# Altium schematic sheet schematic.SchDoc
size A3; SheetNumber: 1; SheetTotal: 1
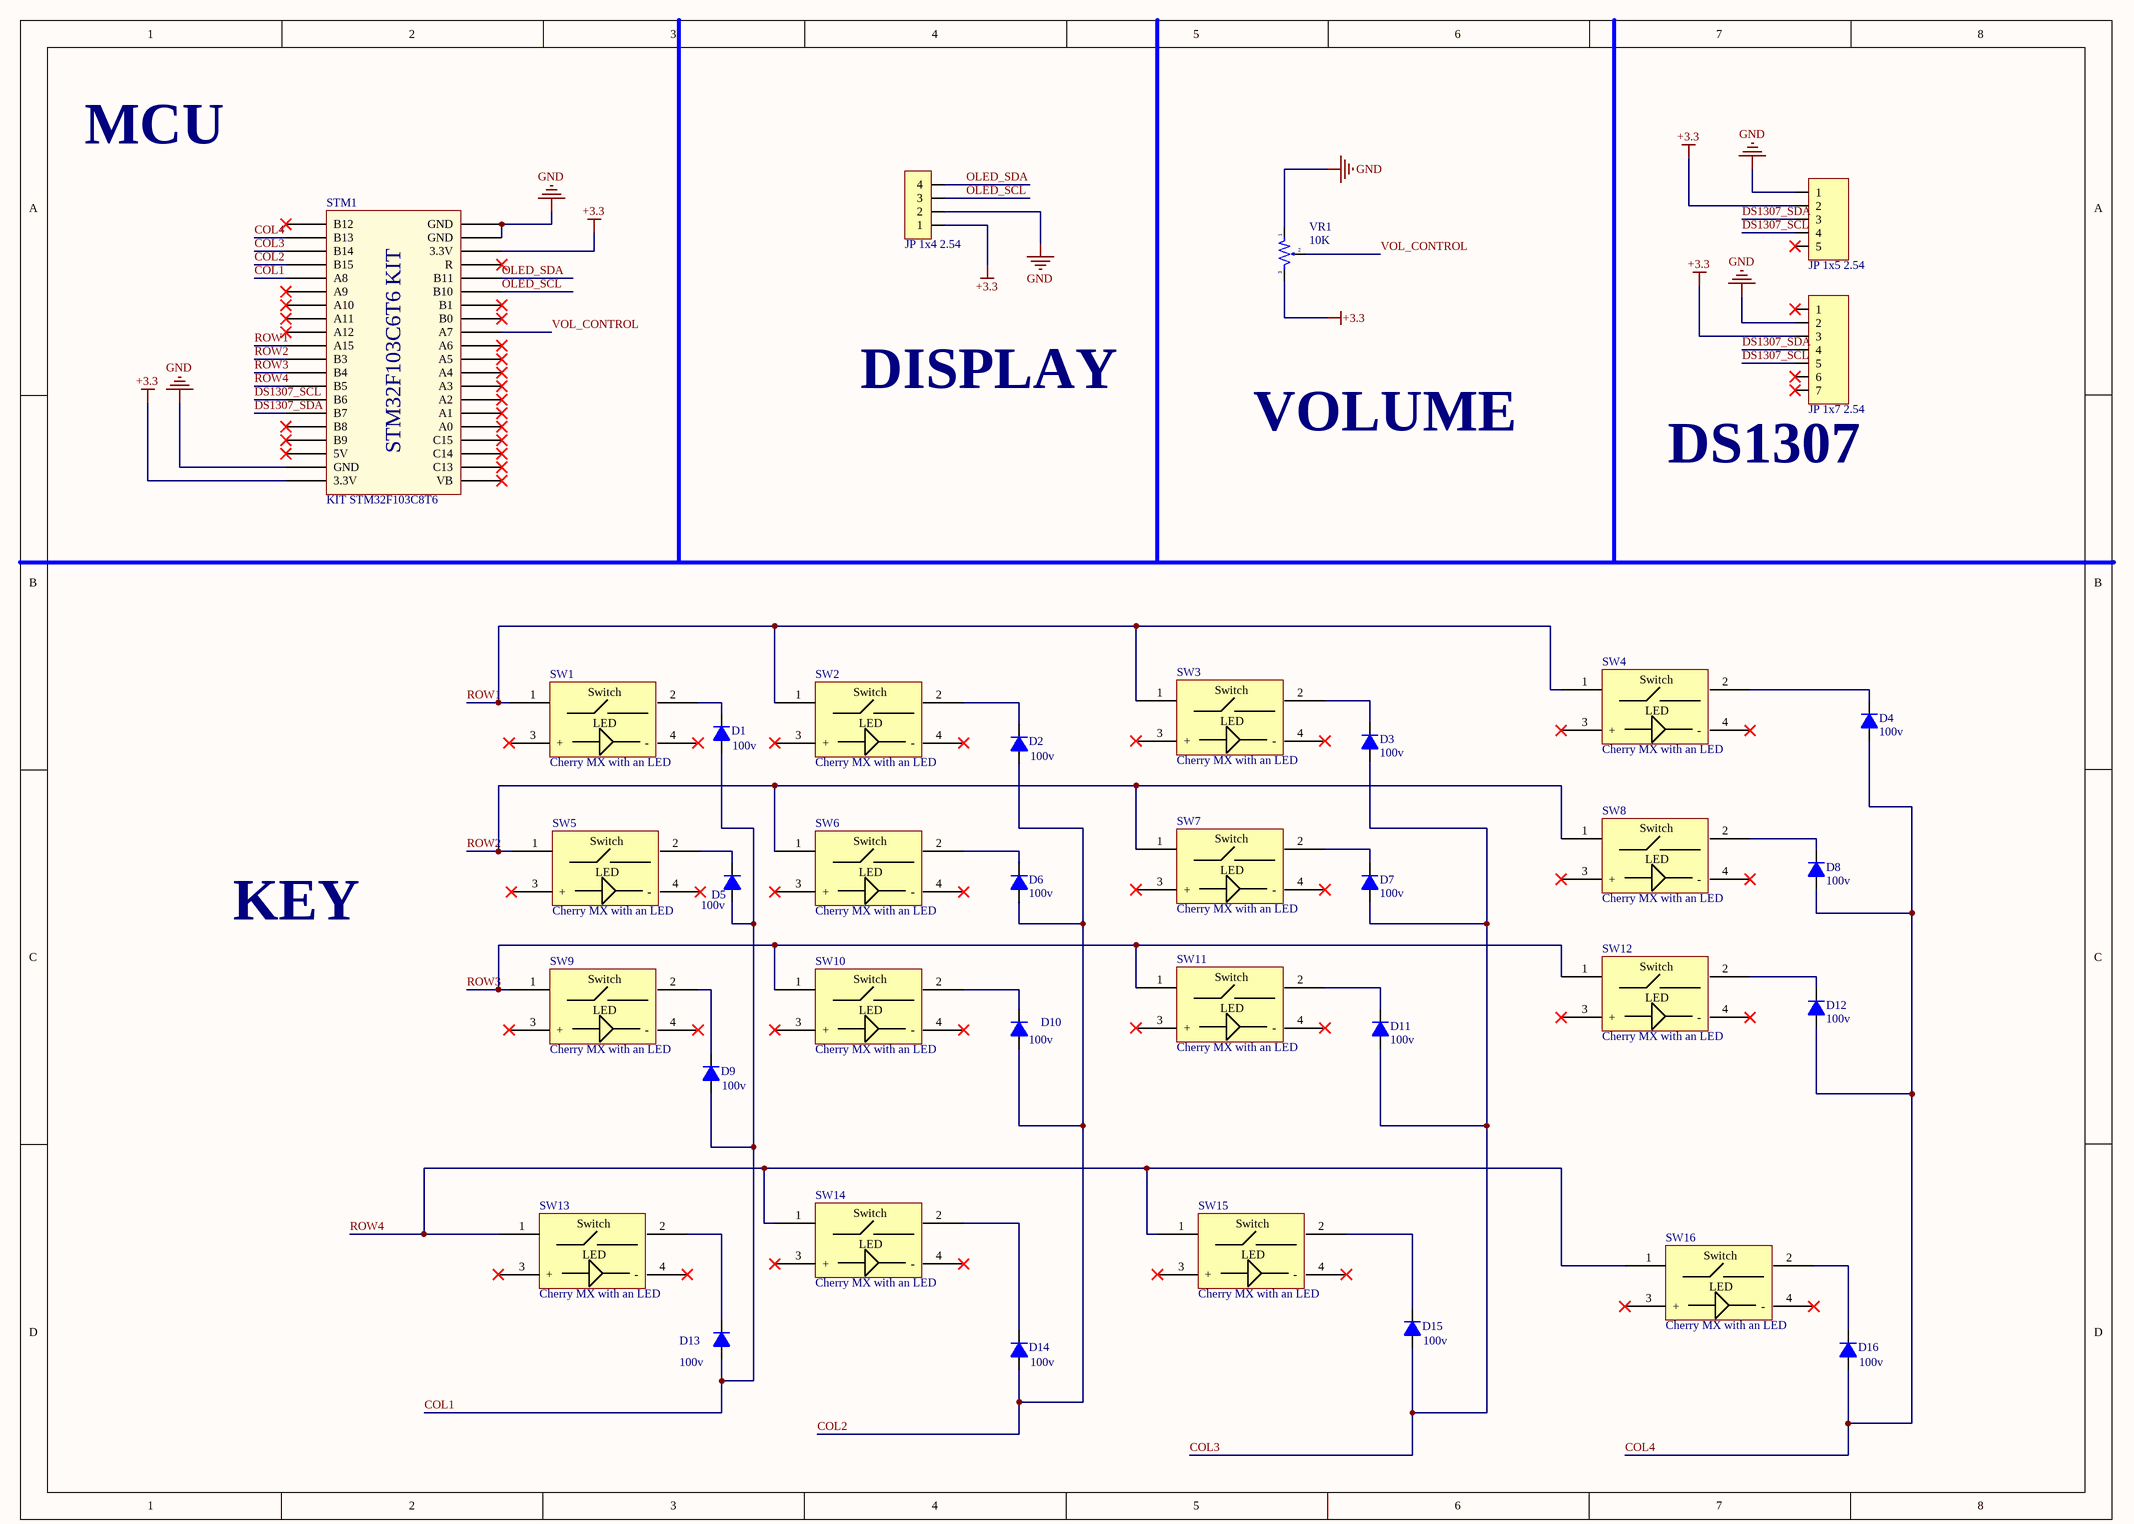
[diagram p0: schematic.SchDoc]

## Parts
D1  100v  [DIODE 0.5A]
D2  100v  [DIODE 0.5A]
D3  100v  [DIODE 0.5A]
D4  100v  [DIODE 0.5A]
D5  100v  [DIODE 0.5A]
D6  100v  [DIODE 0.5A]
D7  100v  [DIODE 0.5A]
D8  100v  [DIODE 0.5A]
D9  100v  [DIODE 0.5A]
D10  100v  [DIODE 0.5A]
D11  100v  [DIODE 0.5A]
D12  100v  [DIODE 0.5A]
D13  100v  [DIODE 0.5A]
D14  100v  [DIODE 0.5A]
D15  100v  [DIODE 0.5A]
D16  100v  [DIODE 0.5A]
JP1  JP 1x4 2.54  [JP 1x4 CT]
JP2  JP 1x5 2.54  [JP 1x5 CT]
JP3  JP 1x7 2.54  [JP 1x7 CT]
STM1  KIT STM32F103C8T6  [STM32F103 KIT]
SW1  Cherry MX with an LED  [MX_Cherry_LED]
SW2  Cherry MX with an LED  [MX_Cherry_LED]
SW3  Cherry MX with an LED  [MX_Cherry_LED]
SW4  Cherry MX with an LED  [MX_Cherry_LED]
SW5  Cherry MX with an LED  [MX_Cherry_LED]
SW6  Cherry MX with an LED  [MX_Cherry_LED]
SW7  Cherry MX with an LED  [MX_Cherry_LED]
SW8  Cherry MX with an LED  [MX_Cherry_LED]
SW9  Cherry MX with an LED  [MX_Cherry_LED]
SW10  Cherry MX with an LED  [MX_Cherry_LED]
SW11  Cherry MX with an LED  [MX_Cherry_LED]
SW12  Cherry MX with an LED  [MX_Cherry_LED]
SW13  Cherry MX with an LED  [MX_Cherry_LED]
SW14  Cherry MX with an LED  [MX_Cherry_LED]
SW15  Cherry MX with an LED  [MX_Cherry_LED]
SW16  Cherry MX with an LED  [MX_Cherry_LED]
VR1  10K  [Bien Tro Volume Don]

## Nets
+3.3: JP1.1 JP2.2 JP3.3 STM1.20(3.3V) STM1.38(3.3V) VR1.3
GND: JP1.2 JP2.1 JP3.2 STM1.19(GND) STM1.39(GND) STM1.40(GND) VR1.1
COL1: D1.1(A) D5.1(A) D9.1(A) D13.1(A) STM1.5(A8)
COL2: D2.1(A) D6.1(A) D10.1(A) D14.1(A) STM1.4(B15)
COL3: D3.1(A) D7.1(A) D11.1(A) D15.1(A) STM1.3(B14)
COL4: D4.1(A) D8.1(A) D12.1(A) D16.1(A) STM1.2(B13)
DS1307_SCL: JP2.4 JP3.5 STM1.14(B6)
DS1307_SDA: JP2.3 JP3.4 STM1.15(B7)
OLED_SCL: JP1.3 STM1.35(B10)
OLED_SDA: JP1.4 STM1.36(B11)
ROW1: STM1.10(A15) SW1.1 SW2.1 SW3.1 SW4.1
ROW2: STM1.11(B3) SW5.1 SW6.1 SW7.1 SW8.1
ROW3: STM1.12(B4) SW9.1 SW10.1 SW11.1 SW12.1
ROW4: STM1.13(B5) SW13.1 SW14.1 SW15.1 SW16.1
VOL_CONTROL: STM1.32(A7) VR1.2
NetD1_2: D1.2(K) SW1.2
NetD2_2: D2.2(K) SW2.2
NetD3_2: D3.2(K) SW3.2
NetD4_2: D4.2(K) SW4.2
NetD5_2: D5.2(K) SW5.2
NetD6_2: D6.2(K) SW6.2
NetD7_2: D7.2(K) SW7.2
NetD8_2: D8.2(K) SW8.2
NetD9_2: D9.2(K) SW9.2
NetD10_2: D10.2(K) SW10.2
NetD11_2: D11.2(K) SW11.2
NetD12_2: D12.2(K) SW12.2
NetD13_2: D13.2(K) SW13.2
NetD14_2: D14.2(K) SW14.2
NetD15_2: D15.2(K) SW15.2
NetD16_2: D16.2(K) SW16.2

Not connected (* = marked no-connect by the designer): JP2 5*; JP3 1* 6* 7*; STM1 1(B12)* 6(A9)* 7(A10)* 8(A11)* 9(A12)* 16(B8)* 17(B9)* 18(5V)* 21(VB)* 22(C13)* 23(C14)* 24(C15)* 25(A0)* 26(A1)* 27(A2)* 28(A3)* 29(A4)* 30(A5)* 31(A6)* 33(B0)* 34(B1)* 37(R)*; SW1 3(+)* 4(-)*; SW2 3(+)* 4(-)*; SW3 3(+)* 4(-)*; SW4 3(+)* 4(-)*; SW5 3(+)* 4(-)*; SW6 3(+)* 4(-)*; SW7 3(+)* 4(-)*; SW8 3(+)* 4(-)*; SW9 3(+)* 4(-)*; SW10 3(+)* 4(-)*; SW11 3(+)* 4(-)*; SW12 3(+)* 4(-)*; SW13 3(+)* 4(-)*; SW14 3(+)* 4(-)*; SW15 3(+)* 4(-)*; SW16 3(+)* 4(-)*

## Notes on the sheet
- MCU
- DISPLAY
- VOLUME
- (near JP3) DS1307
- KEY
- (in symbol MX_Cherry_LED) Switch; LED
- (in symbol STM32f103 Bluepill) STM32F103C6T6 KIT

## Library data of the parts
D1-D16 = Diode 1N4148: Cắm; Ten_Linh_Kien: Diode 1N4148 DO35 450mA 100V ( 1N4148 DIP); Don_Vi: Con; Ma_Hang: MH001065; Ghi Chu: *; Kieu_Chan: *; Chung_Loai: Cắm
JP1 = JP 1x4 2.54 Cai Thang: Cắm; Ten_Linh_Kien: Jump Đơn Cái 2.54MM 1x20P Thẳng; Don_Vi: Con; Ma_Hang: MH004006; Ghi_Chu: *; Kieu_Chan: *; Chung_Loai: Cắm
JP2 = JP 1x5 2.54 Cai Thang: Cắm; Ten_Linh_Kien: Jump Đơn Cái 2.54MM 1x20P Thẳng; Don_Vi: Con; Ma_Hang: MH004006; Ghi_Chu: *; Kieu_Chan: *; Chung_Loai: Cắm
JP3 = JP 1x7 2.54 Cai Thang: Cắm; Ten_Linh_Kien: Jump Đơn Cái 2.54MM 1x20P Thẳng; Don_Vi: Con; Ma_Hang: MH004006; Ghi_Chu: *; Kieu_Chan: *; Chung_Loai: Cắm
STM1 = STM32f103 Bluepill: KIT STM32F103C8T6 Bluepill
SW1-SW16 = MX_Cherry_LED
VR1 = Triet Ap Don 10k: Cắm; Don_Vi: Con; Ten_Linh_Kien: Triết Áp Đơn B10K; Ma_Hang: MH001417; Kieu_Chan: *; Chung_Loai: Cắm